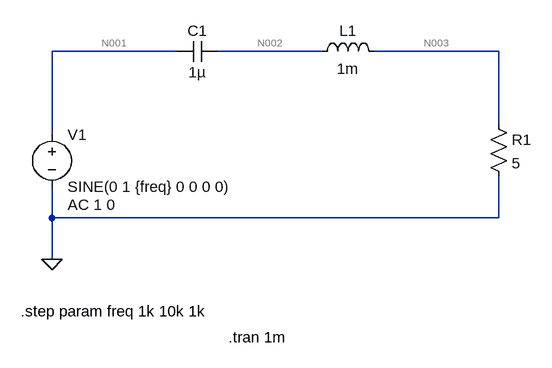
[diagram p0: schematic seriese-lc.asc]
seriese-lc.asc, the LTspice schematic file:
Version 4.1
SHEET 1 880 680
WIRE 96 112 -96 112
WIRE 320 112 160 112
WIRE 592 112 400 112
WIRE 592 224 592 112
WIRE -96 240 -96 112
WIRE -96 368 -96 320
WIRE 592 368 592 304
WIRE 592 368 -96 368
WIRE -96 432 -96 368
FLAG -96 432 0
SYMBOL voltage -96 224 R0
WINDOW 123 24 124 Left 2
WINDOW 39 0 0 Left 0
SYMATTR InstName V1
SYMATTR Value SINE(0 1 {freq} 0 0 0 0)
SYMATTR Value2 AC 1 0
SYMBOL cap 160 96 R90
WINDOW 0 0 32 VBottom 2
WINDOW 3 32 32 VTop 2
SYMATTR InstName C1
SYMATTR Value 1µ
SYMBOL ind 304 128 R270
WINDOW 0 32 56 VTop 2
WINDOW 3 5 56 VBottom 2
SYMATTR InstName L1
SYMATTR Value 1m
SYMBOL res 576 208 R0
SYMATTR InstName R1
SYMATTR Value 5
TEXT -144 512 Left 2 !.step param freq 1k 10k 1k
TEXT 176 552 Left 2 !.tran 1m

The netlist it stands for:
* seriese-lc.asc
V1 N001 0 SINE(0 1 {freq} 0 0 0 0) AC 1 0
C1 N002 N001 1µ
L1 N002 N003 1m
R1 N003 0 5
.step param freq 1k 10k 1k
.tran 1m
.backanno
.end

* Results of the author's LTspice run, read from the files saved beside the schematic
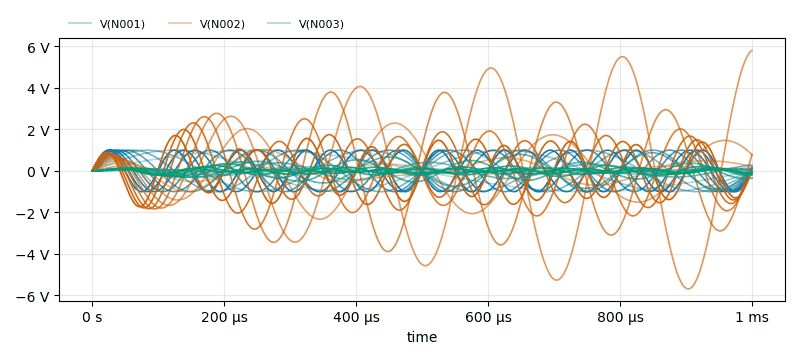
[diagram p1: Transient Analysis of seriese-lc.asc, plotted from the saved traces]
* Transient Analysis, 10 runs:
*   V(N001) [freq=1000]: min -1 V, max 1 V, average 20.94 µV, rms 707.1 mV, last 0 V
*   V(N001) [freq=2000]: min -1 V, max 1 V, average 17.42 µV, rms 707.2 mV, last 0 V
*   V(N001) [freq=3000]: min -999.4 mV, max 1 V, average 36.56 µV, rms 707.1 mV, last 0 V
*   V(N001) [freq=4000]: min -1 V, max 999.9 mV, average 46.98 µV, rms 707.1 mV, last 0 V
*   V(N001) [freq=5000]: min -999.6 mV, max 1 V, average 32.84 µV, rms 707.1 mV, last 0 V
*   V(N001) [freq=6000]: min -1 V, max 1 V, average 21.96 µV, rms 707.1 mV, last 0 V
*   V(N001) [freq=7000]: min -1 V, max 1 V, average 28.52 µV, rms 707.1 mV, last 0 V
*   V(N001) [freq=8000]: min -999.8 mV, max 999.8 mV, average 11.98 µV, rms 707 mV, last 0 V
*   V(N002) [freq=1000]: min -154.7 mV, max 200.7 mV, average 5.829 mV, rms 76.76 mV, last 33.01 mV
*   V(N002) [freq=2000]: min -521.4 mV, max 375.8 mV, average 13.18 mV, rms 208.5 mV, last 84.95 mV
*   V(N002) [freq=3000]: min -1.002 V, max 1.028 V, average 25.15 mV, rms 493.7 mV, last 211.6 mV
*   V(N002) [freq=4000]: min -2.325 V, max 2.301 V, average 51.99 mV, rms 1.298 V, last 778.5 mV
*   V(N002) [freq=5000]: min -5.68 V, max 5.806 V, average -15.76 mV, rms 3.066 V, last 5.806 V
*   V(N002) [freq=6000]: min -3.888 V, max 3.795 V, average -72.62 mV, rms 2.234 V, last 791 mV
*   V(N002) [freq=7000]: min -2.807 V, max 2.614 V, average -42.01 mV, rms 1.487 V, last 206.6 mV
*   V(N002) [freq=8000]: min -2.033 V, max 2.319 V, average -29.9 mV, rms 1.198 V, last 87.49 mV
*   V(N003) [freq=1000]: min -38.32 mV, max 52.79 mV, average -167 µV, rms 25.14 mV, last 29.98 mV
*   V(N003) [freq=2000]: min -105.4 mV, max 95.6 mV, average -431.6 µV, rms 57.09 mV, last 68.07 mV
*   V(N003) [freq=3000]: min -219.5 mV, max 190.8 mV, average -1.054 mV, rms 110.2 mV, last 131.2 mV
*   V(N003) [freq=4000]: min -426 mV, max 412.5 mV, average -3.883 mV, rms 238.1 mV, last 279.8 mV
*   V(N003) [freq=5000]: min -903.4 mV, max 876.9 mV, average -28.99 mV, rms 478.9 mV, last 66.19 mV
*   V(N003) [freq=6000]: min -527.6 mV, max 534.1 mV, average -3.951 mV, rms 303.4 mV, last -343.7 mV
*   V(N003) [freq=7000]: min -336.7 mV, max 350.9 mV, average -1.032 mV, rms 175.5 mV, last -205.2 mV
*   V(N003) [freq=8000]: min -249.2 mV, max 261.1 mV, average -438.3 µV, rms 125.2 mV, last -147.4 mV